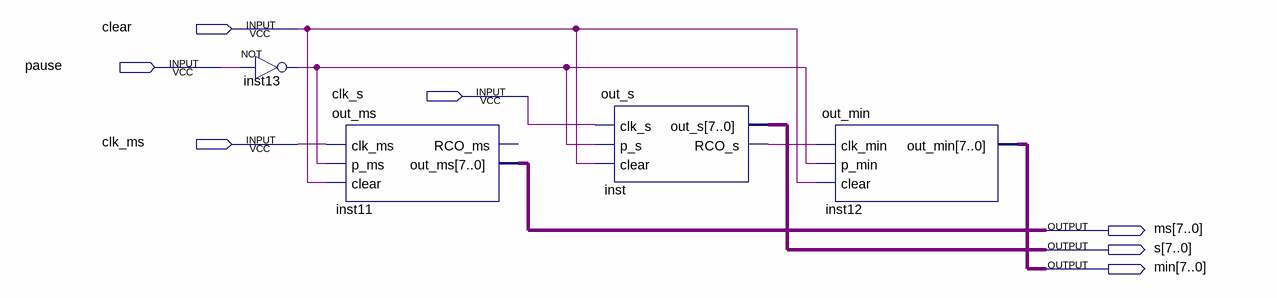
[diagram p0: schematic sheet]
// Quartus schematic counter_time.bdf as structural Verilog: 4 symbols, 7 pins
module counter_time (
  input  clear,
  input  pause,
  input  clk_s,
  input  clk_ms,
  output [7:0] ms,
  output [7:0] s,
  output [7:0] min
);

  wire inst13_out, inst_rco_s;

  not inst13 (inst13_out, pause);
  out_ms inst11 (.clk_ms(clk_ms), .p_ms(inst13_out), .clear(clear), .out_ms(ms));  // open: RCO_ms
  out_s inst (.clk_s(clk_s), .p_s(inst13_out), .clear(clear), .out_s(s), .RCO_s(inst_rco_s));
  out_min inst12 (.clk_min(inst_rco_s), .p_min(inst13_out), .clear(clear), .out_min(min));
endmodule
